# EAGLE design ExtraCore (EAGLE 5.11)
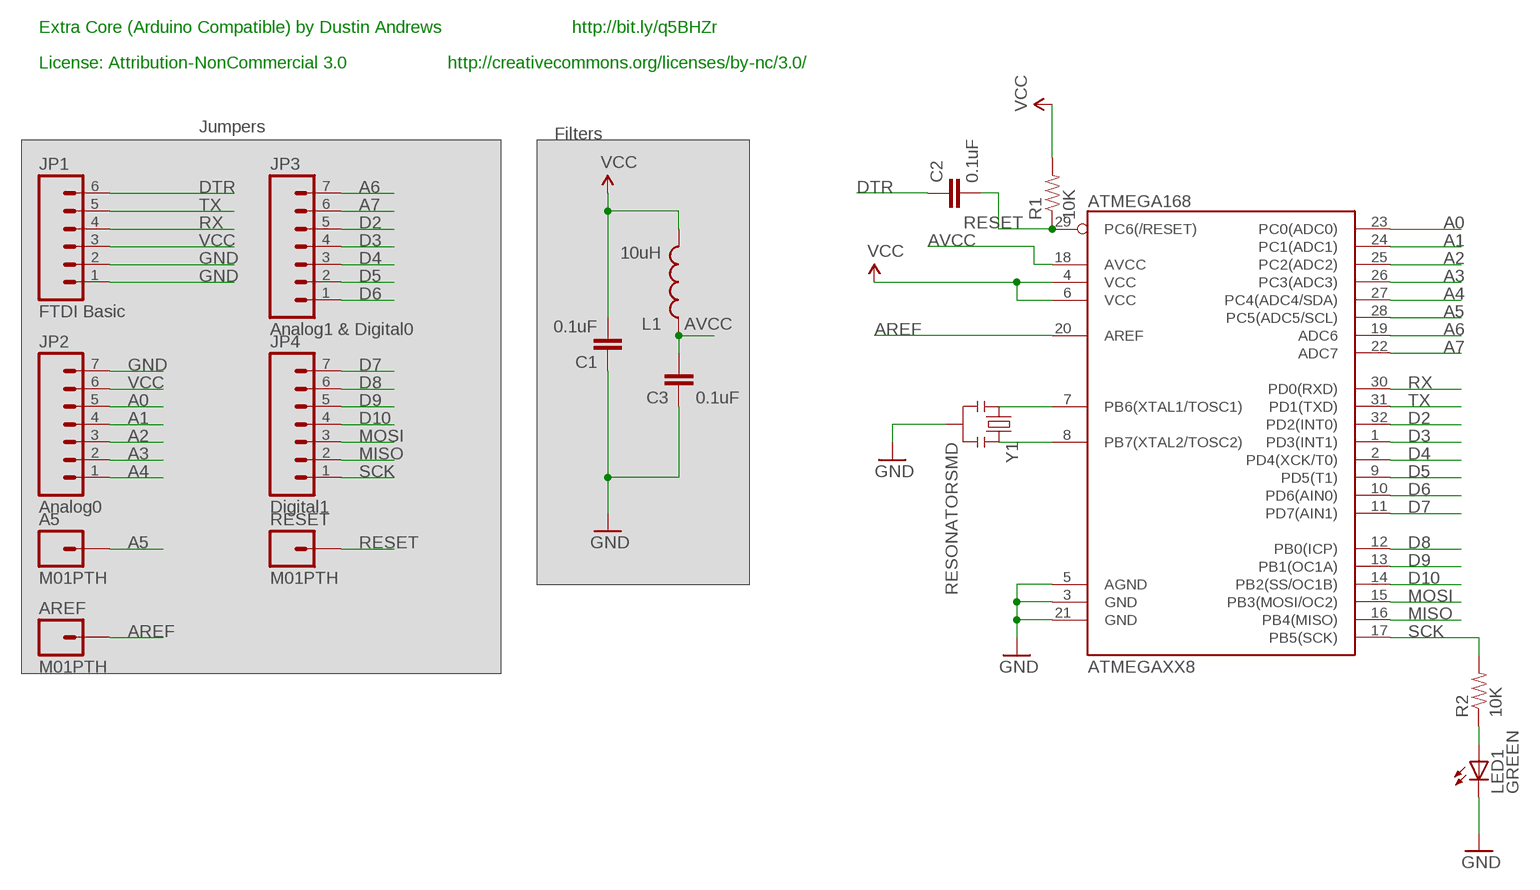
[diagram p0: schematic, sheet 1]

## Parts
A5  M01PTH  [1X01]
AREF  M01PTH  [1X01]
ATMEGAXX8  ATMEGA168  [TQFP32-08]
C1  0.1uF  CAP0402-CAP  [0402-CAP]
C2  0.1uF  CAP0402-CAP  [0402-CAP]
C3  0.1uF  CAP0402-CAP  [0402-CAP]
JP1  FTDI Basic  M06SIP  [1X06]
JP2  Analog0  M07  [1X07]
JP3  Analog1 & Digital0  M07  [1X07]
JP4  Digital1  M07  [1X07]
L1  10uH  INDUCTOR0603  [0603]
LED1  GREEN  LED0603  [LED-0603]
R1  10K  RESISTOR0402-RES  [0402-RES]
R2  10K  RESISTOR0402-RES  [0402-RES]
RESET  M01PTH  [1X01]
Y1  RESONATORSMD  [RESONATOR-SMD]

## Nets
A0: ATMEGAXX8.23(PC0(ADC0)) JP2.5
A1: ATMEGAXX8.24(PC1(ADC1)) JP2.4
A2: ATMEGAXX8.25(PC2(ADC2)) JP2.3
A3: ATMEGAXX8.26(PC3(ADC3)) JP2.2
A4: ATMEGAXX8.27(PC4(ADC4/SDA)) JP2.1
A5: A5.1 ATMEGAXX8.28(PC5(ADC5/SCL))
A6: ATMEGAXX8.19(ADC6) JP3.7
A7: ATMEGAXX8.22(ADC7) JP3.6
AREF: AREF.1 ATMEGAXX8.20(AREF)
AVCC: ATMEGAXX8.18(AVCC) C3.2 L1.1
D2: ATMEGAXX8.32(PD2(INT0)) JP3.5
D3: ATMEGAXX8.1(PD3(INT1)) JP3.4
D4: ATMEGAXX8.2(PD4(XCK/T0)) JP3.3
D5: ATMEGAXX8.9(PD5(T1)) JP3.2
D6: ATMEGAXX8.10(PD6(AIN0)) JP3.1
D7: ATMEGAXX8.11(PD7(AIN1)) JP4.7
D8: ATMEGAXX8.12(PB0(ICP)) JP4.6
D9: ATMEGAXX8.13(PB1(OC1A)) JP4.5
D10: ATMEGAXX8.14(PB2(SS/OC1B)) JP4.4
DTR: C2.1 JP1.6
GND: ATMEGAXX8.3(GND) ATMEGAXX8.5(AGND) ATMEGAXX8.21(GND) C1.1 C3.1 JP1.1 JP1.2 JP2.7 LED1.C Y1.2
MISO: ATMEGAXX8.16(PB4(MISO)) JP4.2
MOSI: ATMEGAXX8.15(PB3(MOSI/OC2)) JP4.3
N$3: ATMEGAXX8.7(PB6(XTAL1/TOSC1)) Y1.1
N$4: ATMEGAXX8.8(PB7(XTAL2/TOSC2)) Y1.3
N$6: LED1.A R2.1
RESET: ATMEGAXX8.29(PC6(/RESET)) C2.2 R1.1 RESET.1
RX: ATMEGAXX8.30(PD0(RXD)) JP1.4
SCK: ATMEGAXX8.17(PB5(SCK)) JP4.1 R2.2
TX: ATMEGAXX8.31(PD1(TXD)) JP1.5
VCC: ATMEGAXX8.4(VCC) ATMEGAXX8.6(VCC) C1.2 JP1.3 JP2.6 L1.2 R1.2

## Notes on the sheet
- Extra Core (Arduino Compatible) by Dustin Andrews | http://bit.ly/q5BHZr
- License: Attribution-NonCommercial 3.0 | http://creativecommons.org/licenses/by-nc/3.0/
- Jumpers
- Filters

## Library data of the parts
A5 AREF RESET = SparkFun:M01: Header 1 Standard 1-pin 0.1" header. Use with straight break away headers (SKU : PRT-00116), right angle break away headers (PRT-00553), swiss pins (PRT-00743), machine pins (PRT-00117), and female headers (PRT-00115).
ATMEGAXX8 = SparkFun:ATMEGA168
C1-C3 = SparkFun:CAP: Capacitor Standard 0603 ceramic capacitor, and 0.1" leaded capacitor.
JP1 = SparkFun:M06: Header 6 Standard 6-pin 0.1" header. Use with straight break away headers (SKU : PRT-00116), right angle break away headers (PRT-00553), swiss pins (PRT-00743), machine pins (PRT-00117), and female headers (PRT-00115). Molex polarized connector foot print use with SKU : PRT-08094 with associated crimp pins and housings. NOTES ON THE VARIANTS LOCK and LOCK_LONGPADS... This footprint was designed to help hold the alignment of a through-hole component (i.e. 6-pin header) while soldering it into place. You may notice that each hole has been shifted either up or down by 0.005 of an inch from it's more standard position (which is a perfectly straight line). This slight alteration caused the pins (the squares in the middle) to touch the edges of the holes. Because they are alternating, it causes a "brace" to hold the component in place. 0.005 has proven to be the perfect amount of "off-center" position when using our standard breakaway headers. Although looks a little odd when you look at the bare footprint, once you have a header in there, the alteration is very hard to notice. Also, if you push a header all the way into place, it is covered up entirely on the bottom side. This idea of altering the position of holes to aid alignment will be further integrated into the Sparkfun Library for other footprints. It can help hold any component with 3 or more connection pins.
JP2-JP4 = SparkFun:M07: Header 7 Standard 7-pin 0.1" header. Use with straight break away headers (SKU : PRT-00116), right angle break away headers (PRT-00553), swiss pins (PRT-00743), machine pins (PRT-00117), and female headers (PRT-00115). NOTES ON THE VARIANTS LOCK and LOCK_LONGPADS... This footprint was designed to help hold the alignment of a through-hole component (i.e. 7-pin header) while soldering it into place. You may notice that each hole has been shifted either up or down by 0.005 of an inch from it's more standard position (which is usually a perfectly straight line). This slight alteration caused the pins (the squares in the middle) to touch the edges of the holes. Because they are alternating, it causes a "brace" to hold the header in place. 0.005 has proven to be the perfect amount of "off-center" position when using our standard breakaway headers. Although looks a little odd when you look at the bare footprint, once you have a header in there, the alteration is very hard to notice. Also, if you push a header all the way into place, it is covered up entirely on the bottom side. This idea of altering the position of holes to aid alignment will be further integrated into the Sparkfun Library for other footprints. It can help hold any component with 3 or more connection pins.
L1 = SparkFun:INDUCTOR: Inductors Basic Inductor/Choke - 0603 and 1206. Footprints are not proven and vary greatly between part numbers.
LED1 = SparkFun:LED: LEDs Standard schematic elements and footprints for 5mm, 3mm, 1206, and 0603 sized LEDs. 5mm - Spark Fun Electronics SKU : COM-00529 (and others)
R1 R2 = SparkFun:RESISTOR: Resistor Basic schematic elements and footprints for 0603, 1206, and PTH resistors.
Y1 = SparkFun:RESONATOR: Resonator Small SMD resonator. This is the itty bitty 10/20MHz resonators with built in caps. CSTCE10M0G55 and CSTCE20M0V53. Footprint has been reviewed closely but hasn't been tested yet.

## Board
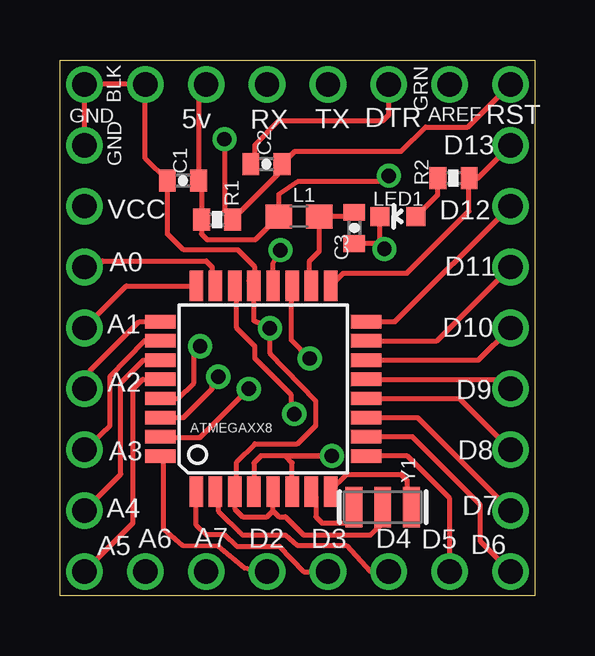
[diagram p1: board, top side]
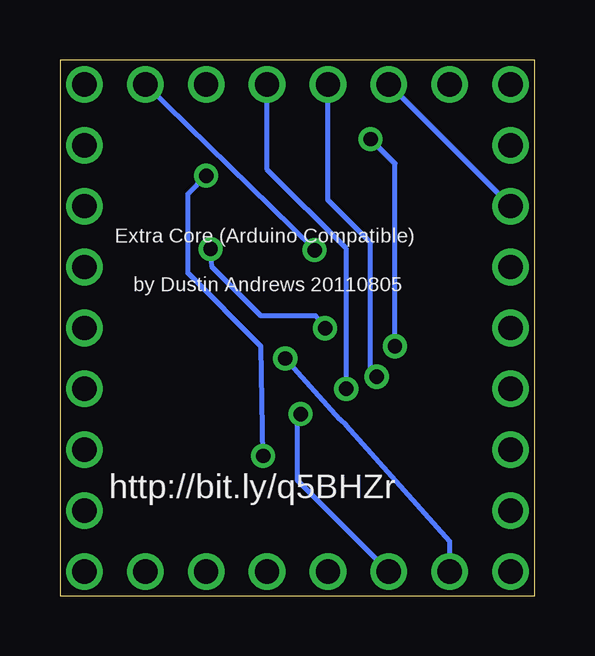
[diagram p2: board, bottom side, seen from below]

Size 19.81 x 22.35 mm. Coordinates in mm from the lower left corner, seen from the top.
Outline: 0,0 0,22.35 19.81,22.35 19.81,0 0,0
Copper layers (1*16): Top 0.0178mm / dielectric 1.4986mm / Bottom 0.0178mm
Design rules "SSC-EAGLE-2Lyr_v1.0.0.3": minimum track width 6mil, minimum drill 14mil, track to track 6mil, track to pad 6mil, pad to pad 6mil, via to via 6mil, smd to smd 6mil, copper to edge 20mil, drill to drill 16mil, minimum pad ring 8mil, minimum via ring 8mil, stop-mask expansion 3mil, vias tented up to drill 0mil, thermal gap 10mil

### Footprints (pad centres in the part's own frame; a part is rotated, then mirrored left to right if it is on the bottom)
1X01 = drill 1.016 pad 1.422 round: 1 0,0
TQFP32-08 = smd 1.27 x 0.559: 1 -4.293,2.8; 2 -4.293,2; 3 -4.293,1.2; 4 -4.293,0.4; 5 -4.293,-0.4; 6 -4.293,-1.2; 7 -4.293,-2; 8 -4.293,-2.8; 17 4.293,-2.8; 18 4.293,-2; 19 4.293,-1.2; 20 4.293,-0.4; 21 4.293,0.4; 22 4.293,1.2; 23 4.293,2; 24 4.293,2.8 | smd 0.559 x 1.27: 9 -2.8,-4.293; 10 -2,-4.293; 11 -1.2,-4.293; 12 -0.4,-4.293; 13 0.4,-4.293; 14 1.2,-4.293; 15 2,-4.293; 16 2.8,-4.293; 25 2.8,4.293; 26 2,4.293; 27 1.2,4.293; 28 0.4,4.293; 29 -0.4,4.293; 30 -1.2,4.293; 31 -2,4.293; 32 -2.8,4.293
0402-CAP = smd 0.7 x 0.9: 1 -0.65,0; 2 0.65,0
1X06 = drill 1.016 pad 1.422 round: 1 0,0; 2 2.54,0; 3 5.08,0; 4 7.62,0; 5 10.16,0; 6 12.7,0
1X07 = drill 1.016 pad 1.422 round: 1 0,0; 2 2.54,0; 3 5.08,0; 4 7.62,0; 5 10.16,0; 6 12.7,0; 7 15.24,0
0603 = smd 1.1 x 1: 1 -0.85,0; 2 0.85,0
LED-0603 = smd 0.8 x 0.8: A 0,-0.75; C 0,0.75
0402-RES = smd 0.7 x 0.9: 1 -0.65,0; 2 0.65,0
RESONATOR-SMD = smd 0.7 x 1.7: 1 -1.2,0; 2 0,0; 3 1.2,0

### Placement (x,y rotation side)
A5  1.02,1.02 0 top
AREF  16.26,21.34 0 top
ATMEGAXX8  8.48,8.64 90 top
C1  5.13,17.32 0 top
C2  8.61,18.01 0 top
C3  12.28,15.35 90 top
JP1  1.02,21.34 0 top
JP2  1.02,3.56 90 top
JP3  18.8,1.02 180 top
JP4  18.8,18.8 270 top
L1  9.97,15.83 180 top
LED1  14.1,15.82 90 top
R1  6.55,15.7 180 top
R2  16.41,17.42 0 top
RESET  18.8,21.34 0 top
Y1  13.46,3.71 0 top

### Tracks (layer width: path | path; a pad name or v marks a point on that pad's centre or on a via)
A0
  Top 0.203: ATMEGAXX8.23 6.35,13.06 6.35,13.72 6.1,13.97 1.78,13.97 1.52,13.72 JP2.5
A1
  Top 0.203: ATMEGAXX8.24 2.77,12.93 JP2.4
A2
  Top 0.203: ATMEGAXX8.25 3.31,11.44 1.27,9.4 1.27,8.89 JP2.3
A3
  Top 0.203: ATMEGAXX8.26 3.52,10.64 2.09,9.14 2.09,7.11 JP2.2
A4
  Top 0.203: ATMEGAXX8.27 3.49,9.84 2.54,8.89 2.54,5.08 JP2.1
A5
  Top 0.203: ATMEGAXX8.28 3.45,9.04 3.05,8.64 3.05,3.05 A5.1
A6  (via drill 0.6)
  Top 0.203: v10.41,9.91 9.65,10.67 9.65,12.9 ATMEGAXX8.19
  Bottom 0.203: v10.41,9.91 8.13,7.37 7.87,7.11 3.56,2.29 JP3.7
A7  (via drill 0.6)
  Top 0.203: ATMEGAXX8.22 7.37,12.85 7.37,11.18 8.13,10.41 8.13,9.91 9.65,8.38 9.65,7.71 v9.77,7.59
  Bottom 0.203: JP3.6 9.91,4.83 9.91,7.46 v9.77,7.59
AREF  (via drill 0.6)
  Top 0.203: ATMEGAXX8.20 8.88,13.86 v9.19,14.42
  Bottom 0.203: v9.19,14.42 9.23,14.47 AREF.1
AVCC
  Top 0.203: ATMEGAXX8.18 10.41,13 10.41,13.97 10.82,14.38 L1.1 12.1,15.83 C3.2
D2
  Top 0.203: JP3.5 7.7,1.17 6.6,2.09 5.11,2.11 4.32,2.79 4.32,5.71 ATMEGAXX8.32
D3
  Top 0.203: JP3.4 10.16,1.02 9.14,2.08 7.37,2.08 6.86,2.54 6.1,2.54 5.68,2.95 ATMEGAXX8.1
D4
  Top 0.203: ATMEGAXX8.2 6.6,4.22 6.6,3.56 7.62,2.54 9.4,2.54 9.91,2.11 11.94,2.11 12.95,1.02 JP3.3
D5
  Top 0.203: JP3.2 16.26,4.06 14.48,5.84 ATMEGAXX8.9
D6
  Top 0.203: JP3.1 17.53,2.29 17.53,3.81 14.7,6.64 ATMEGAXX8.10
D7
  Top 0.203: JP4.7 14.92,7.44 ATMEGAXX8.11
D8
  Top 0.203: JP4.6 16.66,8.24 ATMEGAXX8.12
D9
  Top 0.203: JP4.5 18.4,9.04 ATMEGAXX8.13
D10
  Top 0.203: JP4.4 17.46,9.84 ATMEGAXX8.14
DTR
  Top 0.203: C2.1 8.13,18.18 8.13,18.8 9.14,19.81 13.46,19.81 13.72,20.07 JP1.6
GND  (via drill 0.6)
  Top 0.203: JP2.7 JP1.1 JP1.2 3.56,18.25 C1.1 4.48,15.08 4.52,15.08 4.52,15.07 5.16,14.43 7.42,14.43 8.13,13.72 8.13,12.97 ATMEGAXX8.21 | Y1.2 13.46,3.05 12.95,2.54 10.16,2.54 9.4,3.3 9.14,3.3 8.89,3.56 | 8.89,3.56 ATMEGAXX8.5 | 8.89,3.56 8.64,3.3 7.62,3.3 7.28,3.64 ATMEGAXX8.3 7.37,4.43 7.37,5.59 8.13,6.35 9.91,6.35 10.67,7.11 10.67,8.13 8.76,10.12 v8.76,11.16 8.08,11.47 ATMEGAXX8.21 | ATMEGAXX8.21 7.87,13.14 | LED1.C 13.35,14.59 v13.53,14.47 13.24,14.7 C3.1
  Bottom 0.203: v13.53,14.47 13.46,13.72 11.43,11.68 9.14,11.68 v8.76,11.16
MISO
  Top 0.203: JP4.2 13.98,11.44 ATMEGAXX8.16
MOSI
  Top 0.203: JP4.3 15.72,10.64 ATMEGAXX8.15
N$3
  Top 0.203: ATMEGAXX8.7 10.67,4.16 10.67,3.3 10.92,3.05 12.19,3.05 12.26,3.12 Y1.1
N$4
  Top 0.203: Y1.3 14.48,3.89 14.48,4.83 14.22,5.08 11.94,5.08 11.28,4.43 ATMEGAXX8.8
N$6
  Top 0.203: LED1.A 15.76,16.74 R2.1
RESET  (via drill 0.6)
  Top 0.203: RESET.1 17.02,19.56 15.24,19.56 14.22,18.54 9.79,18.54 C2.2 9.26,17.75 R1.1 6.86,16.04 v6.86,19.05 | ATMEGAXX8.29 4.93,8.24 5.59,8.89 5.59,10.16 v5.84,10.41
  Bottom 0.203: v5.84,10.41 5.84,18.03 v6.86,19.05
RX  (via drill 0.6)
  Top 0.203: ATMEGAXX8.30 5.15,7.44 6.35,8.64 6.35,8.89 v6.6,9.14
  Bottom 0.203: JP1.4 8.64,16.51 6.86,14.73 6.86,9.4 v6.6,9.14
SCK
  Top 0.203: JP4.1 17.42,17.42 R2.2 17.06,16.04 14.48,13.46 11.82,13.46 ATMEGAXX8.17
TX  (via drill 0.6)
  Top 0.203: ATMEGAXX8.31 4.22,6.6 5.84,6.6 v7.87,8.64
  Bottom 0.203: JP1.5 11.18,17.78 7.87,14.48 v7.87,8.64
VCC  (via drill 0.6)
  Top 0.203: JP1.3 5.78,21.02 C1.2 5.9,17.2 R1.2 5.9,15.09 6.14,14.86 8.15,14.86 L1.2 9.12,16.74 9.91,17.27 13.46,17.27 v13.72,17.53 | ATMEGAXX8.4 8.08,5.54 8.38,5.84 v11.34,5.84 9.4,5.84 9.68,5.56 ATMEGAXX8.6
  Bottom 0.203: v13.72,17.53 14.48,16.76 14.48,13.46 11.43,10.41 v11.34,5.84 | JP2.6 JP1.3

### Text on the board
tPlace: GRN | BLK | GND | 5v | TX | DTR | AREF | RST | RX | GND | D13 | VCC | D12 | A0 | D11 | A1 | D10 | A2 | D9 | A3 | D8 | A4 | A5 | A6 | D2 | D7 | A7 | D3 | D4 | D5 | D6
bPlace: Extra Core (Arduino Compatible) | by Dustin Andrews 20110805 | http://bit.ly/q5BHZr